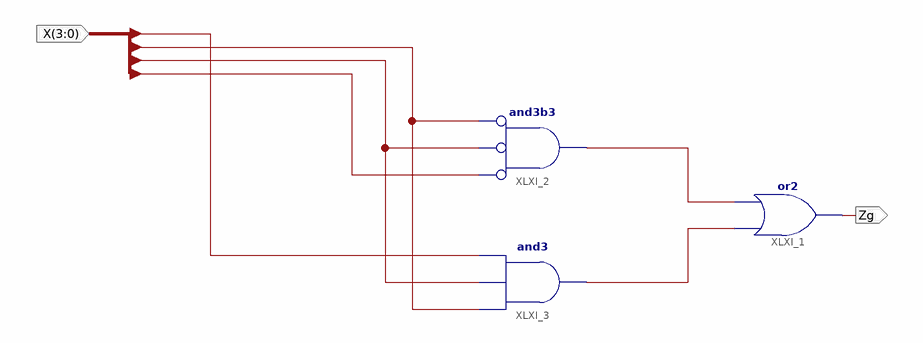
[diagram p0: schematic sheet 1]
// Xilinx ISE schematic g.sch (spartan3e) as structural Verilog: 3 symbols, 2 ports
module g (
  input  [3:0] X,
  output Zg
);

  wire XLXN_1, XLXN_2;

  or XLXI_1 (Zg, XLXN_2, XLXN_1);
  and XLXI_2 (XLXN_1, ~X[3], ~X[2], ~X[1]);  // and3b3
  and XLXI_3 (XLXN_2, X[1], X[2], X[0]);
endmodule
